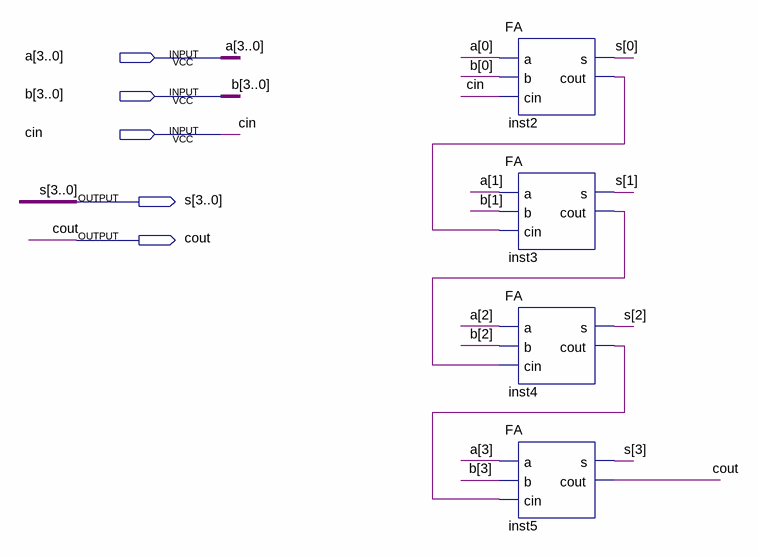
[diagram p0: schematic sheet]
// Quartus schematic FA4.bdf as structural Verilog: 4 symbols, 5 pins
module FA4 (
  input  [3:0] a,
  input  [3:0] b,
  input  cin,
  output [3:0] s,
  output cout
);

  wire inst2_cout, inst3_cout, inst4_cout;

  FA inst2 (.a(a[0]), .b(b[0]), .cin(cin), .s(s[0]), .cout(inst2_cout));
  FA inst3 (.a(a[1]), .b(b[1]), .cin(inst2_cout), .s(s[1]), .cout(inst3_cout));
  FA inst4 (.a(a[2]), .b(b[2]), .cin(inst3_cout), .s(s[2]), .cout(inst4_cout));
  FA inst5 (.a(a[3]), .b(b[3]), .cin(inst4_cout), .s(s[3]), .cout(cout));
endmodule
